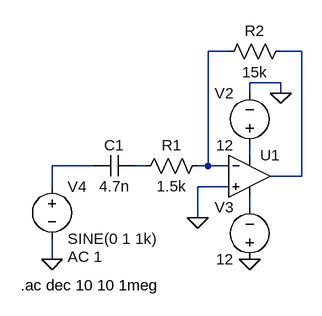
[diagram p0: schematic exp_3_hpf.asc]
exp_3_hpf.asc, the LTspice schematic file:
Version 4
SHEET 1 880 680
WIRE 224 -128 192 -128
WIRE 336 -128 304 -128
WIRE 304 -80 256 -80
WIRE 256 -64 256 -80
WIRE 304 -64 304 -80
WIRE 256 32 256 16
WIRE 16 48 -48 48
WIRE 96 48 80 48
WIRE 192 48 192 -128
WIRE 192 48 176 48
WIRE 224 48 192 48
WIRE 336 64 336 -128
WIRE 336 64 288 64
WIRE -48 80 -48 48
WIRE 224 80 176 80
WIRE 256 112 256 96
WIRE 176 128 176 80
WIRE -48 192 -48 160
FLAG -48 192 0
FLAG 256 192 0
FLAG 304 -64 0
FLAG 176 128 0
SYMBOL Opamps\\UniversalOpamp2 256 64 R0
SYMATTR InstName U1
SYMBOL voltage 256 32 R180
WINDOW 0 24 96 Left 2
WINDOW 3 24 16 Left 2
WINDOW 123 0 0 Left 0
WINDOW 39 0 0 Left 0
SYMATTR InstName V2
SYMATTR Value 12
SYMBOL voltage 256 208 R180
WINDOW 0 24 96 Left 2
WINDOW 3 24 16 Left 2
WINDOW 123 0 0 Left 0
WINDOW 39 0 0 Left 0
SYMATTR InstName V3
SYMATTR Value 12
SYMBOL voltage -48 64 R0
WINDOW 123 24 124 Left 2
WINDOW 39 0 0 Left 0
SYMATTR Value2 AC 1
SYMATTR InstName V4
SYMATTR Value SINE(0 1 1k)
SYMBOL res 192 32 R90
WINDOW 0 0 56 VBottom 2
WINDOW 3 32 56 VTop 2
SYMATTR InstName R1
SYMATTR Value 1.5k
SYMBOL res 320 -144 R90
WINDOW 0 0 56 VBottom 2
WINDOW 3 32 56 VTop 2
SYMATTR InstName R2
SYMATTR Value 15k
SYMBOL cap 80 32 R90
WINDOW 0 0 32 VBottom 2
WINDOW 3 32 32 VTop 2
SYMATTR InstName C1
SYMATTR Value 4.7n
TEXT -96 232 Left 2 !.ac dec 10 10 1meg

The netlist it stands for:
* exp_3_hpf.asc
XU1 0 N001 N003 N006 N002 level.2 Avol=1Meg GBW=10Meg Slew=10Meg ilimit=25m rail=0 Vos=0 phimargin=45 en=0 enk=0 in=0 ink=0 Rin=500Meg  ; pins IN+ IN- V+ V- OUT
V2 N003 0 12
V3 0 N006 12
V4 N004 0 SINE(0 1 1k) AC 1
R1 N001 N005 1.5k
R2 N002 N001 15k
C1 N005 N004 4.7n
.ac dec 10 10 1meg
.lib UniversalOpamps2.sub
.backanno
.end